# Altium schematic sheet TCA_LP_FILTER.SchDoc: My title
size A3; Organization: University of California; Address1: 475 Portola Plaza; Address2: Los Angeles, CA 90095; DocumentNumber: 23; Revision: R01; SheetNumber: 23; SheetTotal: 35
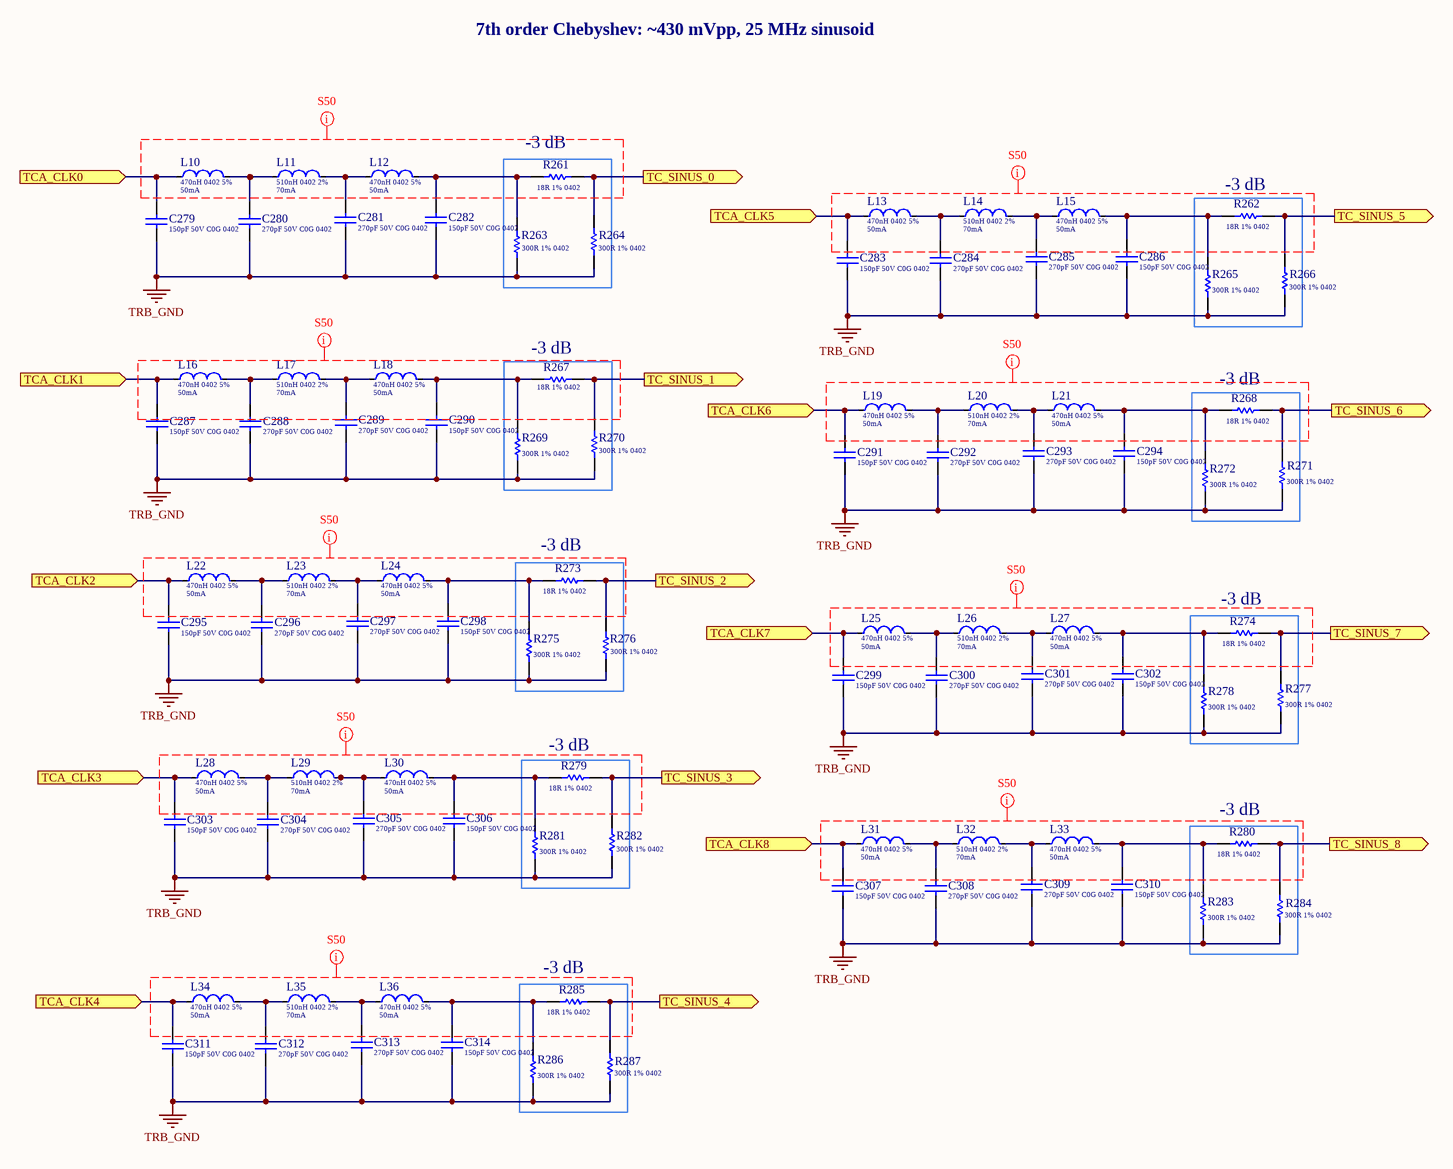
[diagram p0: TCA_LP_FILTER.SchDoc]

## Parts
C279  Capacitance: 150pF 50V C0G 0402  [Cap_TDK_CGA2B2C0G2A151J050BE_150pF]  (hidden comment: Cap_TDK_CGA2B2C0G2A151J050BE_150pF)
C280  Capacitance: 270pF 50V C0G 0402  [Cap_Murata_GCM1555C1H271FA16D_270pF]  (hidden comment: Cap_Murata_GCM1555C1H271FA16D_270pF)
C281  Capacitance: 270pF 50V C0G 0402  [Cap_Murata_GCM1555C1H271FA16D_270pF]  (hidden comment: Cap_Murata_GCM1555C1H271FA16D_270pF)
C282  Capacitance: 150pF 50V C0G 0402  [Cap_TDK_CGA2B2C0G2A151J050BE_150pF]  (hidden comment: Cap_TDK_CGA2B2C0G2A151J050BE_150pF)
C283  Capacitance: 150pF 50V C0G 0402  [Cap_TDK_CGA2B2C0G2A151J050BE_150pF]  (hidden comment: Cap_TDK_CGA2B2C0G2A151J050BE_150pF)
C284  Capacitance: 270pF 50V C0G 0402  [Cap_Murata_GCM1555C1H271FA16D_270pF]  (hidden comment: Cap_Murata_GCM1555C1H271FA16D_270pF)
C285  Capacitance: 270pF 50V C0G 0402  [Cap_Murata_GCM1555C1H271FA16D_270pF]  (hidden comment: Cap_Murata_GCM1555C1H271FA16D_270pF)
C286  Capacitance: 150pF 50V C0G 0402  [Cap_TDK_CGA2B2C0G2A151J050BE_150pF]  (hidden comment: Cap_TDK_CGA2B2C0G2A151J050BE_150pF)
C287  Capacitance: 150pF 50V C0G 0402  [Cap_TDK_CGA2B2C0G2A151J050BE_150pF]  (hidden comment: Cap_TDK_CGA2B2C0G2A151J050BE_150pF)
C288  Capacitance: 270pF 50V C0G 0402  [Cap_Murata_GCM1555C1H271FA16D_270pF]  (hidden comment: Cap_Murata_GCM1555C1H271FA16D_270pF)
C289  Capacitance: 270pF 50V C0G 0402  [Cap_Murata_GCM1555C1H271FA16D_270pF]  (hidden comment: Cap_Murata_GCM1555C1H271FA16D_270pF)
C290  Capacitance: 150pF 50V C0G 0402  [Cap_TDK_CGA2B2C0G2A151J050BE_150pF]  (hidden comment: Cap_TDK_CGA2B2C0G2A151J050BE_150pF)
C291  Capacitance: 150pF 50V C0G 0402  [Cap_TDK_CGA2B2C0G2A151J050BE_150pF]  (hidden comment: Cap_TDK_CGA2B2C0G2A151J050BE_150pF)
C292  Capacitance: 270pF 50V C0G 0402  [Cap_Murata_GCM1555C1H271FA16D_270pF]  (hidden comment: Cap_Murata_GCM1555C1H271FA16D_270pF)
C293  Capacitance: 270pF 50V C0G 0402  [Cap_Murata_GCM1555C1H271FA16D_270pF]  (hidden comment: Cap_Murata_GCM1555C1H271FA16D_270pF)
C294  Capacitance: 150pF 50V C0G 0402  [Cap_TDK_CGA2B2C0G2A151J050BE_150pF]  (hidden comment: Cap_TDK_CGA2B2C0G2A151J050BE_150pF)
C295  Capacitance: 150pF 50V C0G 0402  [Cap_TDK_CGA2B2C0G2A151J050BE_150pF]  (hidden comment: Cap_TDK_CGA2B2C0G2A151J050BE_150pF)
C296  Capacitance: 270pF 50V C0G 0402  [Cap_Murata_GCM1555C1H271FA16D_270pF]  (hidden comment: Cap_Murata_GCM1555C1H271FA16D_270pF)
C297  Capacitance: 270pF 50V C0G 0402  [Cap_Murata_GCM1555C1H271FA16D_270pF]  (hidden comment: Cap_Murata_GCM1555C1H271FA16D_270pF)
C298  Capacitance: 150pF 50V C0G 0402  [Cap_TDK_CGA2B2C0G2A151J050BE_150pF]  (hidden comment: Cap_TDK_CGA2B2C0G2A151J050BE_150pF)
C299  Capacitance: 150pF 50V C0G 0402  [Cap_TDK_CGA2B2C0G2A151J050BE_150pF]  (hidden comment: Cap_TDK_CGA2B2C0G2A151J050BE_150pF)
C300  Capacitance: 270pF 50V C0G 0402  [Cap_Murata_GCM1555C1H271FA16D_270pF]  (hidden comment: Cap_Murata_GCM1555C1H271FA16D_270pF)
C301  Capacitance: 270pF 50V C0G 0402  [Cap_Murata_GCM1555C1H271FA16D_270pF]  (hidden comment: Cap_Murata_GCM1555C1H271FA16D_270pF)
C302  Capacitance: 150pF 50V C0G 0402  [Cap_TDK_CGA2B2C0G2A151J050BE_150pF]  (hidden comment: Cap_TDK_CGA2B2C0G2A151J050BE_150pF)
C303  Capacitance: 150pF 50V C0G 0402  [Cap_TDK_CGA2B2C0G2A151J050BE_150pF]  (hidden comment: Cap_TDK_CGA2B2C0G2A151J050BE_150pF)
C304  Capacitance: 270pF 50V C0G 0402  [Cap_Murata_GCM1555C1H271FA16D_270pF]  (hidden comment: Cap_Murata_GCM1555C1H271FA16D_270pF)
C305  Capacitance: 270pF 50V C0G 0402  [Cap_Murata_GCM1555C1H271FA16D_270pF]  (hidden comment: Cap_Murata_GCM1555C1H271FA16D_270pF)
C306  Capacitance: 150pF 50V C0G 0402  [Cap_TDK_CGA2B2C0G2A151J050BE_150pF]  (hidden comment: Cap_TDK_CGA2B2C0G2A151J050BE_150pF)
C307  Capacitance: 150pF 50V C0G 0402  [Cap_TDK_CGA2B2C0G2A151J050BE_150pF]  (hidden comment: Cap_TDK_CGA2B2C0G2A151J050BE_150pF)
C308  Capacitance: 270pF 50V C0G 0402  [Cap_Murata_GCM1555C1H271FA16D_270pF]  (hidden comment: Cap_Murata_GCM1555C1H271FA16D_270pF)
C309  Capacitance: 270pF 50V C0G 0402  [Cap_Murata_GCM1555C1H271FA16D_270pF]  (hidden comment: Cap_Murata_GCM1555C1H271FA16D_270pF)
C310  Capacitance: 150pF 50V C0G 0402  [Cap_TDK_CGA2B2C0G2A151J050BE_150pF]  (hidden comment: Cap_TDK_CGA2B2C0G2A151J050BE_150pF)
C311  Capacitance: 150pF 50V C0G 0402  [Cap_TDK_CGA2B2C0G2A151J050BE_150pF]  (hidden comment: Cap_TDK_CGA2B2C0G2A151J050BE_150pF)
C312  Capacitance: 270pF 50V C0G 0402  [Cap_Murata_GCM1555C1H271FA16D_270pF]  (hidden comment: Cap_Murata_GCM1555C1H271FA16D_270pF)
C313  Capacitance: 270pF 50V C0G 0402  [Cap_Murata_GCM1555C1H271FA16D_270pF]  (hidden comment: Cap_Murata_GCM1555C1H271FA16D_270pF)
C314  Capacitance: 150pF 50V C0G 0402  [Cap_TDK_CGA2B2C0G2A151J050BE_150pF]  (hidden comment: Cap_TDK_CGA2B2C0G2A151J050BE_150pF)
L10  470nH 0402 5%  Current Rating: 50mA  [TDK_MLF1005GR47JT000_0]
L11  510nH 0402 2%  Current Rating: 70mA  [TDK_MHQ1005PR51GT000_0]
L12  470nH 0402 5%  Current Rating: 50mA  [TDK_MLF1005GR47JT000_0]
L13  470nH 0402 5%  Current Rating: 50mA  [TDK_MLF1005GR47JT000_0]
L14  510nH 0402 2%  Current Rating: 70mA  [TDK_MHQ1005PR51GT000_0]
L15  470nH 0402 5%  Current Rating: 50mA  [TDK_MLF1005GR47JT000_0]
L16  470nH 0402 5%  Current Rating: 50mA  [TDK_MLF1005GR47JT000_0]
L17  510nH 0402 2%  Current Rating: 70mA  [TDK_MHQ1005PR51GT000_0]
L18  470nH 0402 5%  Current Rating: 50mA  [TDK_MLF1005GR47JT000_0]
L19  470nH 0402 5%  Current Rating: 50mA  [TDK_MLF1005GR47JT000_0]
L20  510nH 0402 2%  Current Rating: 70mA  [TDK_MHQ1005PR51GT000_0]
L21  470nH 0402 5%  Current Rating: 50mA  [TDK_MLF1005GR47JT000_0]
L22  470nH 0402 5%  Current Rating: 50mA  [TDK_MLF1005GR47JT000_0]
L23  510nH 0402 2%  Current Rating: 70mA  [TDK_MHQ1005PR51GT000_0]
L24  470nH 0402 5%  Current Rating: 50mA  [TDK_MLF1005GR47JT000_0]
L25  470nH 0402 5%  Current Rating: 50mA  [TDK_MLF1005GR47JT000_0]
L26  510nH 0402 2%  Current Rating: 70mA  [TDK_MHQ1005PR51GT000_0]
L27  470nH 0402 5%  Current Rating: 50mA  [TDK_MLF1005GR47JT000_0]
L28  470nH 0402 5%  Current Rating: 50mA  [TDK_MLF1005GR47JT000_0]
L29  510nH 0402 2%  Current Rating: 70mA  [TDK_MHQ1005PR51GT000_0]
L30  470nH 0402 5%  Current Rating: 50mA  [TDK_MLF1005GR47JT000_0]
L31  470nH 0402 5%  Current Rating: 50mA  [TDK_MLF1005GR47JT000_0]
L32  510nH 0402 2%  Current Rating: 70mA  [TDK_MHQ1005PR51GT000_0]
L33  470nH 0402 5%  Current Rating: 50mA  [TDK_MLF1005GR47JT000_0]
L34  470nH 0402 5%  Current Rating: 50mA  [TDK_MLF1005GR47JT000_0]
L35  510nH 0402 2%  Current Rating: 70mA  [TDK_MHQ1005PR51GT000_0]
L36  470nH 0402 5%  Current Rating: 50mA  [TDK_MLF1005GR47JT000_0]
R261  18R 1% 0402  [RESC0402(1005)_L]
R262  18R 1% 0402  [RESC0402(1005)_L]
R263  300R 1% 0402  [RESC0402(1005)_L]
R264  300R 1% 0402  [RESC0402(1005)_L]
R265  300R 1% 0402  [RESC0402(1005)_L]
R266  300R 1% 0402  [RESC0402(1005)_L]
R267  18R 1% 0402  [RESC0402(1005)_L]
R268  18R 1% 0402  [RESC0402(1005)_L]
R269  300R 1% 0402  [RESC0402(1005)_L]
R270  300R 1% 0402  [RESC0402(1005)_L]
R271  300R 1% 0402  [RESC0402(1005)_L]
R272  300R 1% 0402  [RESC0402(1005)_L]
R273  18R 1% 0402  [RESC0402(1005)_L]
R274  18R 1% 0402  [RESC0402(1005)_L]
R275  300R 1% 0402  [RESC0402(1005)_L]
R276  300R 1% 0402  [RESC0402(1005)_L]
R277  300R 1% 0402  [RESC0402(1005)_L]
R278  300R 1% 0402  [RESC0402(1005)_L]
R279  18R 1% 0402  [RESC0402(1005)_L]
R280  18R 1% 0402  [RESC0402(1005)_L]
R281  300R 1% 0402  [RESC0402(1005)_L]
R282  300R 1% 0402  [RESC0402(1005)_L]
R283  300R 1% 0402  [RESC0402(1005)_L]
R284  300R 1% 0402  [RESC0402(1005)_L]
R285  18R 1% 0402  [RESC0402(1005)_L]
R286  300R 1% 0402  [RESC0402(1005)_L]
R287  300R 1% 0402  [RESC0402(1005)_L]

## Blocks framed on the sheet
-3 dB: R261 R263 R264
-3 dB: R262 R265 R266
-3 dB: R267 R269 R270
-3 dB: R268 R271 R272
-3 dB: R273 R275 R276
-3 dB: R274 R277 R278
-3 dB: R279 R281 R282
-3 dB: R280 R283 R284
-3 dB: R285-R287

## Ports
TC_SINUS_0 (out), TC_SINUS_1 (out), TC_SINUS_2 (out), TC_SINUS_3 (out), TC_SINUS_4 (out), TC_SINUS_5 (out), TC_SINUS_6 (out), TC_SINUS_7 (out), TC_SINUS_8 (out), TCA_CLK0 (in), TCA_CLK1 (in), TCA_CLK2 (in), TCA_CLK3 (in), TCA_CLK4 (in), TCA_CLK5 (in), TCA_CLK6 (in), TCA_CLK7 (in), TCA_CLK8 (in)

## Nets
TRB_GND: C279.1 C280.1 C281.1 C282.1 C283.1 C284.1 C285.1 C286.1 C287.1 C288.1 C289.1 C290.1 C291.1 C292.1 C293.1 C294.1 C295.1 C296.1 C297.1 C298.1 C299.1 C300.1 C301.1 C302.1 C303.1 C304.1 C305.1 C306.1 C307.1 C308.1 C309.1 C310.1 C311.1 C312.1 C313.1 C314.1 R263.1 R264.1 R265.1 R266.1 R269.1 R270.1 R271.1 R272.1 R275.1 R276.1 R277.1 R278.1 R281.1 R282.1 R283.1 R284.1 R286.1 R287.1
TC_SINUS_0: R261.2 R264.2 ; port TC_SINUS_0
TC_SINUS_1: R267.2 R270.2 ; port TC_SINUS_1
TC_SINUS_2: R273.2 R276.2 ; port TC_SINUS_2
TC_SINUS_3: R279.2 R282.2 ; port TC_SINUS_3
TC_SINUS_4: R285.2 R287.2 ; port TC_SINUS_4
TC_SINUS_5: R262.2 R266.2 ; port TC_SINUS_5
TC_SINUS_6: R268.2 R271.2 ; port TC_SINUS_6
TC_SINUS_7: R274.2 R277.2 ; port TC_SINUS_7
TC_SINUS_8: R280.2 R284.2 ; port TC_SINUS_8
TCA_CLK0: C279.2 L10.1 ; port TCA_CLK0
TCA_CLK1: C287.2 L16.1 ; port TCA_CLK1
TCA_CLK2: C295.2 L22.1 ; port TCA_CLK2
TCA_CLK3: C303.2 L28.1 ; port TCA_CLK3
TCA_CLK4: C311.2 L34.1 ; port TCA_CLK4
TCA_CLK5: C283.2 L13.1 ; port TCA_CLK5
TCA_CLK6: C291.2 L19.1 ; port TCA_CLK6
TCA_CLK7: C299.2 L25.1 ; port TCA_CLK7
TCA_CLK8: C307.2 L31.1 ; port TCA_CLK8
NetC280_2: C280.2 L10.2 L11.1
NetC281_2: C281.2 L11.2 L12.1
NetC282_2: C282.2 L12.2 R261.1 R263.2
NetC284_2: C284.2 L13.2 L14.1
NetC285_2: C285.2 L14.2 L15.1
NetC286_2: C286.2 L15.2 R262.1 R265.2
NetC288_2: C288.2 L16.2 L17.1
NetC289_2: C289.2 L17.2 L18.1
NetC290_2: C290.2 L18.2 R267.1 R269.2
NetC292_2: C292.2 L19.2 L20.1
NetC293_2: C293.2 L20.2 L21.1
NetC294_2: C294.2 L21.2 R268.1 R272.2
NetC296_2: C296.2 L22.2 L23.1
NetC297_2: C297.2 L23.2 L24.1
NetC298_2: C298.2 L24.2 R273.1 R275.2
NetC300_2: C300.2 L25.2 L26.1
NetC301_2: C301.2 L26.2 L27.1
NetC302_2: C302.2 L27.2 R274.1 R278.2
NetC304_2: C304.2 L28.2 L29.1
NetC305_2: C305.2 L29.2 L30.1
NetC306_2: C306.2 L30.2 R279.1 R281.2
NetC308_2: C308.2 L31.2 L32.1
NetC309_2: C309.2 L32.2 L33.1
NetC310_2: C310.2 L33.2 R280.1 R283.2
NetC312_2: C312.2 L34.2 L35.1
NetC313_2: C313.2 L35.2 L36.1
NetC314_2: C314.2 L36.2 R285.1 R286.2

## Layout directives
net class S50: (no net found under the mark)

## Notes on the sheet
- 7th order Chebyshev: ~430 mVpp, 25 MHz sinusoid
- 475 Portola Plaza
- GAPS TOF
- igarcia91@g.ucla.edu
- Los Angeles, CA
- 310-825-0344
- Size:
- Date:
- Letter
- Revision:
- Time:
- Sheet
- of
- andrew.peck@cern.ch
- spq@ucla.edu
- File:

## Library data of the parts
C279 C282 C283 C286 C287 C290 C291 C294 C295 C298 C299 C302 C303 C306 C307 C310 C311 C314 = Cap_TDK_CGA2B2C0G2A151J050BE_150pF: CAP 150pF 50V C0G ±1% 0402 (1000 Metric) Thickness 1mm SMD; Supplier 1: Mouser; Supplier Part Number 1: 810-CGA2B2C0G2A151J0
C280 C281 C284 C285 C288 C289 C292 C293 C296 C297 C300 C301 C304 C305 C308 C309 C312 C313 = Cap_Murata_GCM1555C1H271FA16D_270pF: CAP 270pF 50V C0G ±1% 0402; Supplier 1: Mouser; Supplier Part Number 1: 81-GCM1555C1H271FA6D
L10 L12 L13 L15 L16 L18 L19 L21 L22 L24 L25 L27 L28 L30 L31 L33 L34 L36 = Ind_TDK_MLF1005GR47JT000: IND 470nH Shielded Multilayer Inductor 50mA 420 mOhm Max 0402 (1005 Metric); Manufacturer: TDK; Value: 270.0nH; DC Resistance (DCR): 420mOhms; Part Number: MLF1005GR47JT000; ComponentLink2Description: Datasheet; Temperature: -55°C to +125°C; ComponentLink2URL: https://product.tdk.com/info/en/catalog/datasheets/inductor_commercial_decoupling_mlz1608_en.pdf; RoHS: TRUE; Temperature Range High: +125°C; Lead Free: yes; Temperature Range Low: -55°C; Tolerance: ±5%; Package: 0402 (1005); Inductance: 470nH; Supplier 1: Mouser; Supplier Part Number 1: 810-MLF1005GR47JT000
L11 L14 L17 L20 L23 L26 L29 L32 L35 = Ind_TDK_MHQ1005PR51GT000: IND 510nH Shielded Multilayer Inductor 70mA 10.2 Ohm Max 0402 (1005 Metric); Manufacturer: TDK; Value: 510.0nH; DC Resistance (DCR): 10.2Ohms; Part Number: MHQ1005PR51GT000; ComponentLink2Description: Datasheet; Temperature: -55°C to +125°C; ComponentLink2URL: https://product.tdk.com/info/en/catalog/datasheets/inductor_commercial_decoupling_mlz1608_en.pdf; RoHS: TRUE; Temperature Range High: +125°C; Lead Free: yes; Temperature Range Low: -55°C; Tolerance: ±2%; Package: 0402 (1005); Inductance: 510nH; Supplier Part Number 1: 810-MHQ1005PR51GT000; Supplier 1: Mouser
R261 R262 R267 R268 R273 R274 R279 R280 R285 = CMP-1011-00311-1: 18R 0.063W 1% 0402 (1005 Metric)  SMD; Case-EIA: 0402; Value: 18.00 Ohm; Case-Metric: 1005; Tolerance: 1 %; Power: 0.063 W; Technology: SMT
R263-R266 R269-R272 R275-R278 R281-R284 R286 R287 = CMP-1011-00449-1: 300R 0.063W 1% 0402 (1005 Metric)  SMD; Case-EIA: 0402; Value: 300.00 Ohm; Case-Metric: 1005; Tolerance: 1 %; Technology: SMT; Power: 0.063 W